# Altium schematic sheet Mikrolysreklamen17.SchDoc
size A3
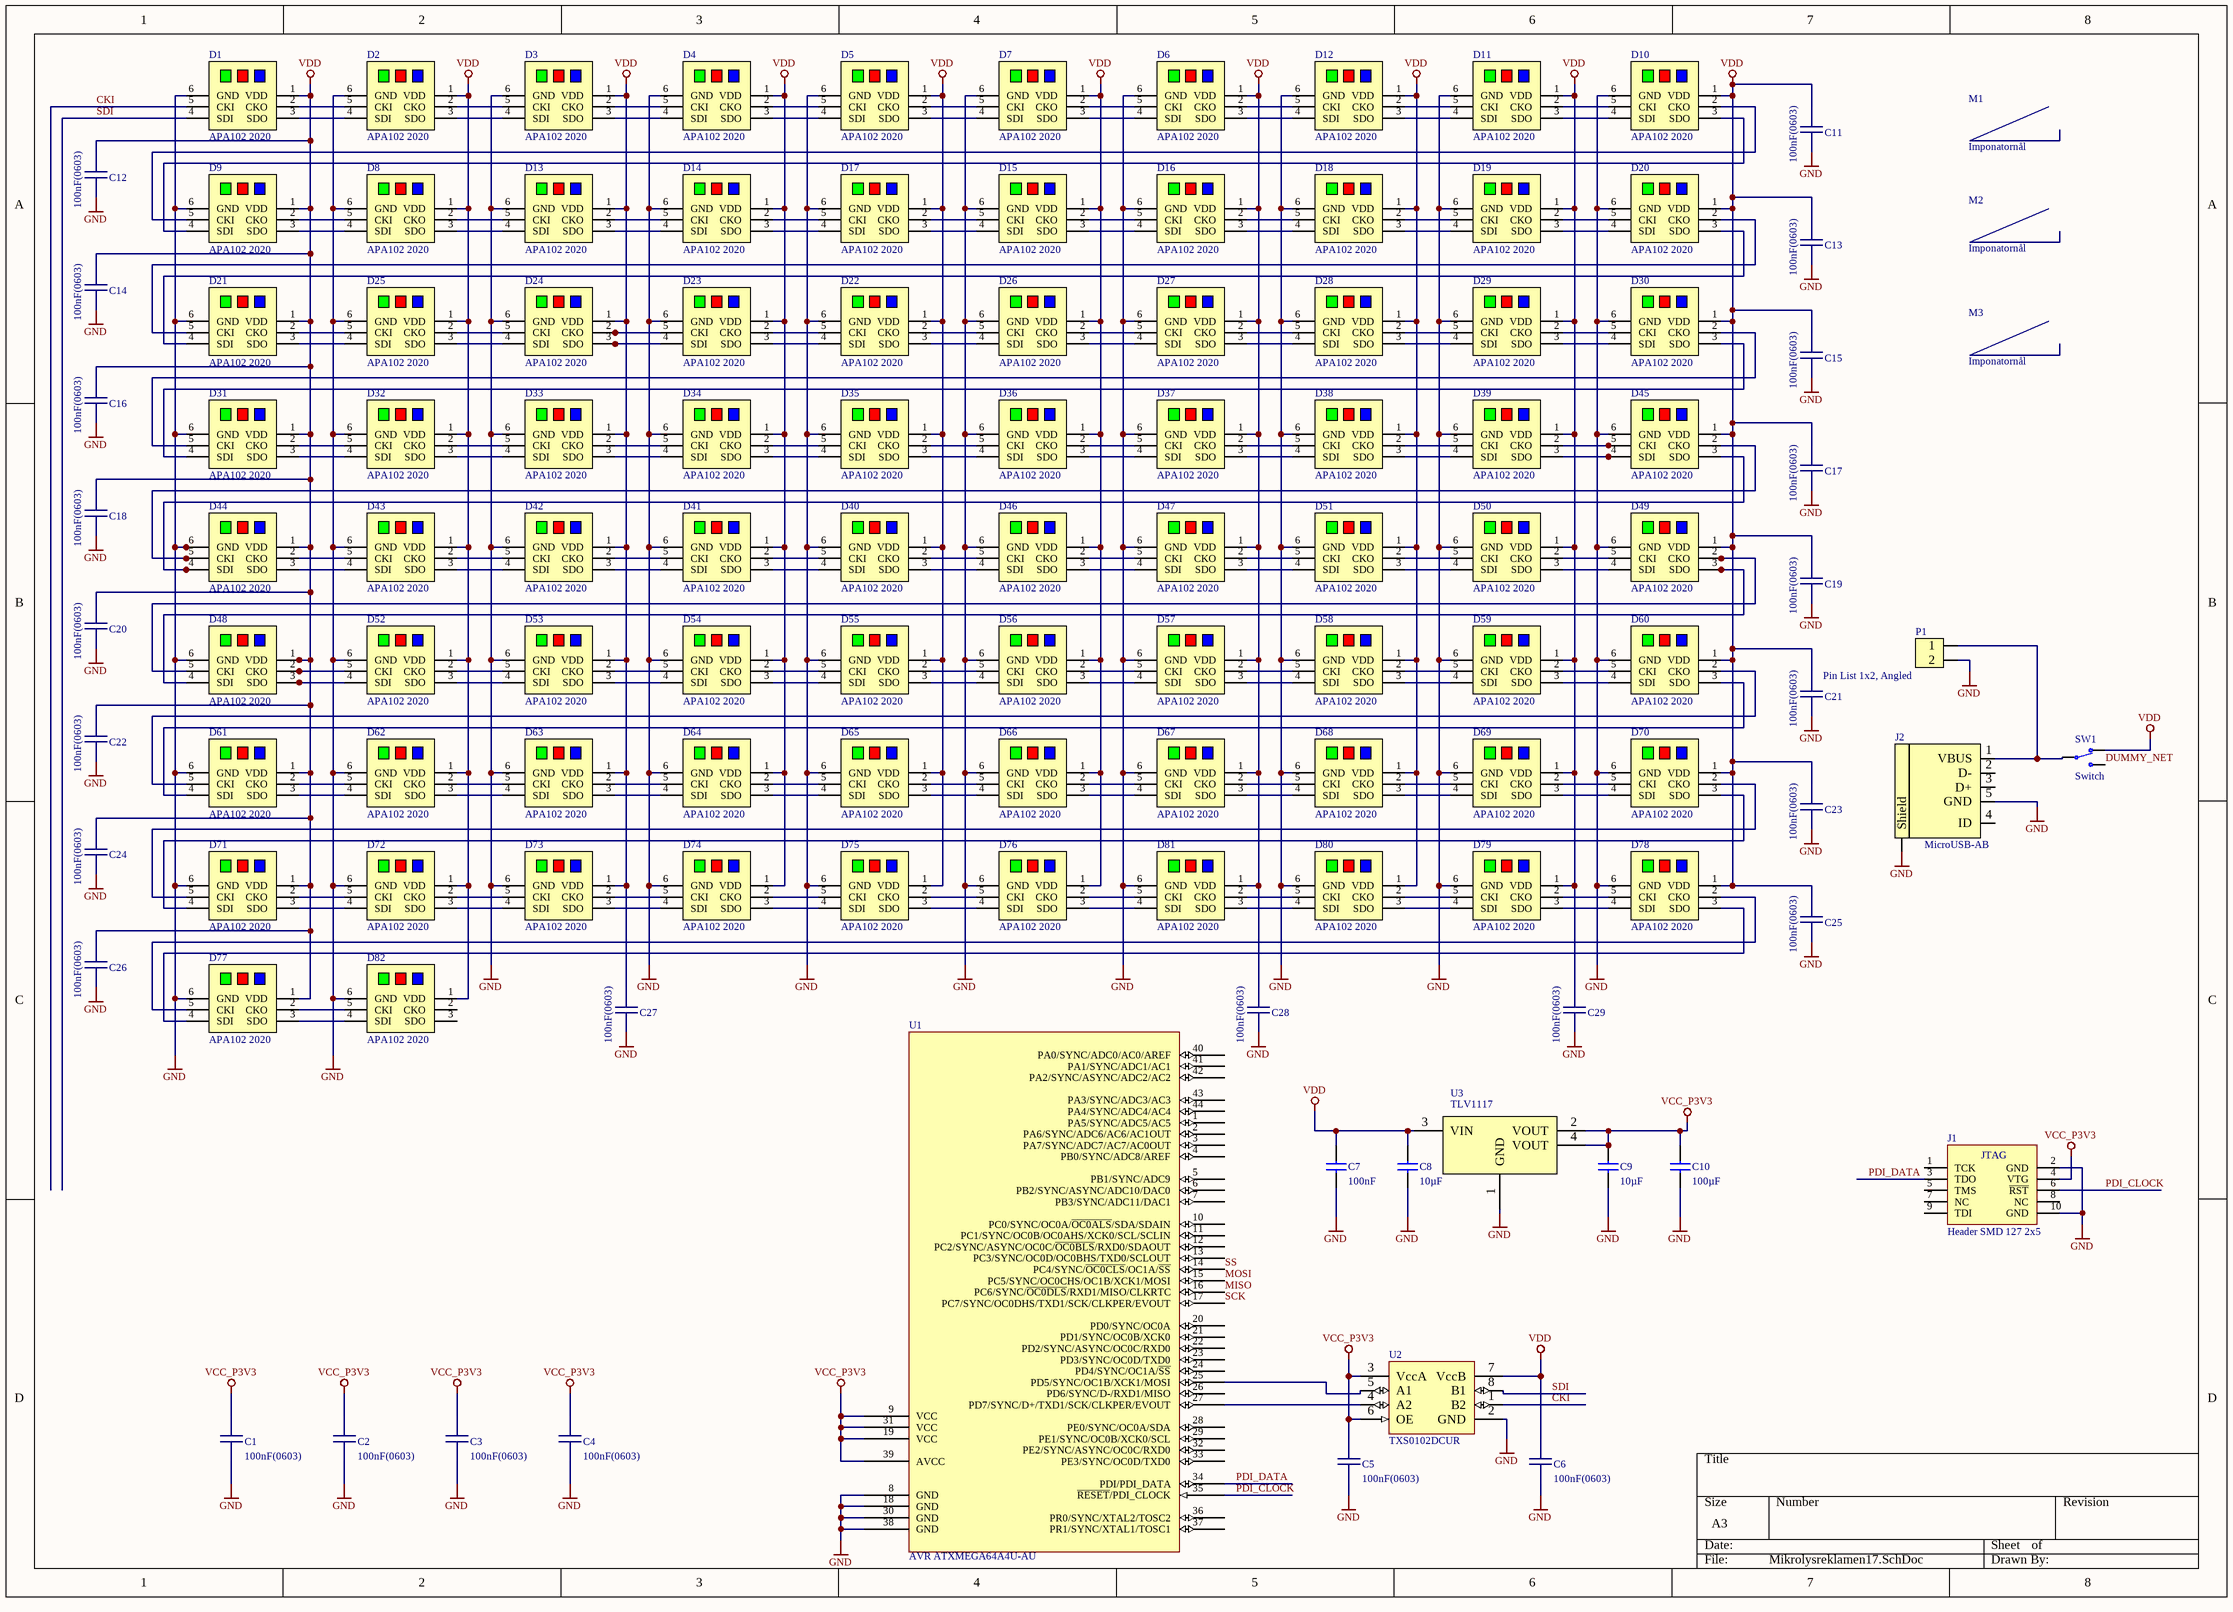
[diagram p0: Mikrolysreklamen17.SchDoc]

## Parts
C1  100nF(0603)  [CAPC0603(1608)55_N]
C2  100nF(0603)  [CAPC0603(1608)55_N]
C3  100nF(0603)  [CAPC0603(1608)55_N]
C4  100nF(0603)  [CAPC0603(1608)55_N]
C5  100nF(0603)  [CAPC0603(1608)55_N]
C6  100nF(0603)  [CAPC0603(1608)55_N]
C7  100nF  [CAPC1005X04L]
C8  10µF  [CAPC1608X06L]
C9  10µF  [CAPC1608X06L]
C10  100µF  [CAPC2012X11L]
C11  100nF(0603)  [CAPC0603(1608)55_N]
C12  100nF(0603)  [CAPC0603(1608)55_N]
C13  100nF(0603)  [CAPC0603(1608)55_N]
C14  100nF(0603)  [CAPC0603(1608)55_N]
C15  100nF(0603)  [CAPC0603(1608)55_N]
C16  100nF(0603)  [CAPC0603(1608)55_N]
C17  100nF(0603)  [CAPC0603(1608)55_N]
C18  100nF(0603)  [CAPC0603(1608)55_N]
C19  100nF(0603)  [CAPC0603(1608)55_N]
C20  100nF(0603)  [CAPC0603(1608)55_N]
C21  100nF(0603)  [CAPC0603(1608)55_N]
C22  100nF(0603)  [CAPC0603(1608)55_N]
C23  100nF(0603)  [CAPC0603(1608)55_N]
C24  100nF(0603)  [CAPC0603(1608)55_N]
C25  100nF(0603)  [CAPC0603(1608)55_N]
C26  100nF(0603)  [CAPC0603(1608)55_N]
C27  100nF(0603)  [CAPC0603(1608)55_N]
C28  100nF(0603)  [CAPC0603(1608)55_N]
C29  100nF(0603)  [CAPC0603(1608)55_N]
D1  APA102 2020  [PCBComponent_1]
D2  APA102 2020  [PCBComponent_1]
D3  APA102 2020  [PCBComponent_1]
D4  APA102 2020  [PCBComponent_1]
D5  APA102 2020  [PCBComponent_1]
D6  APA102 2020  [PCBComponent_1]
D7  APA102 2020  [PCBComponent_1]
D8  APA102 2020  [PCBComponent_1]
D9  APA102 2020  [PCBComponent_1]
D10  APA102 2020  [PCBComponent_1]
D11  APA102 2020  [PCBComponent_1]
D12  APA102 2020  [PCBComponent_1]
D13  APA102 2020  [PCBComponent_1]
D14  APA102 2020  [PCBComponent_1]
D15  APA102 2020  [PCBComponent_1]
D16  APA102 2020  [PCBComponent_1]
D17  APA102 2020  [PCBComponent_1]
D18  APA102 2020  [PCBComponent_1]
D19  APA102 2020  [PCBComponent_1]
D20  APA102 2020  [PCBComponent_1]
D21  APA102 2020  [PCBComponent_1]
D22  APA102 2020  [PCBComponent_1]
D23  APA102 2020  [PCBComponent_1]
D24  APA102 2020  [PCBComponent_1]
D25  APA102 2020  [PCBComponent_1]
D26  APA102 2020  [PCBComponent_1]
D27  APA102 2020  [PCBComponent_1]
D28  APA102 2020  [PCBComponent_1]
D29  APA102 2020  [PCBComponent_1]
D30  APA102 2020  [PCBComponent_1]
D31  APA102 2020  [PCBComponent_1]
D32  APA102 2020  [PCBComponent_1]
D33  APA102 2020  [PCBComponent_1]
D34  APA102 2020  [PCBComponent_1]
D35  APA102 2020  [PCBComponent_1]
D36  APA102 2020  [PCBComponent_1]
D37  APA102 2020  [PCBComponent_1]
D38  APA102 2020  [PCBComponent_1]
D39  APA102 2020  [PCBComponent_1]
D40  APA102 2020  [PCBComponent_1]
D41  APA102 2020  [PCBComponent_1]
D42  APA102 2020  [PCBComponent_1]
D43  APA102 2020  [PCBComponent_1]
D44  APA102 2020  [PCBComponent_1]
D45  APA102 2020  [PCBComponent_1]
D46  APA102 2020  [PCBComponent_1]
D47  APA102 2020  [PCBComponent_1]
D48  APA102 2020  [PCBComponent_1]
D49  APA102 2020  [PCBComponent_1]
D50  APA102 2020  [PCBComponent_1]
D51  APA102 2020  [PCBComponent_1]
D52  APA102 2020  [PCBComponent_1]
D53  APA102 2020  [PCBComponent_1]
D54  APA102 2020  [PCBComponent_1]
D55  APA102 2020  [PCBComponent_1]
D56  APA102 2020  [PCBComponent_1]
D57  APA102 2020  [PCBComponent_1]
D58  APA102 2020  [PCBComponent_1]
D59  APA102 2020  [PCBComponent_1]
D60  APA102 2020  [PCBComponent_1]
D61  APA102 2020  [PCBComponent_1]
D62  APA102 2020  [PCBComponent_1]
D63  APA102 2020  [PCBComponent_1]
D64  APA102 2020  [PCBComponent_1]
D65  APA102 2020  [PCBComponent_1]
D66  APA102 2020  [PCBComponent_1]
D67  APA102 2020  [PCBComponent_1]
D68  APA102 2020  [PCBComponent_1]
D69  APA102 2020  [PCBComponent_1]
D70  APA102 2020  [PCBComponent_1]
D71  APA102 2020  [PCBComponent_1]
D72  APA102 2020  [PCBComponent_1]
D73  APA102 2020  [PCBComponent_1]
D74  APA102 2020  [PCBComponent_1]
D75  APA102 2020  [PCBComponent_1]
D76  APA102 2020  [PCBComponent_1]
D77  APA102 2020  [PCBComponent_1]
D78  APA102 2020  [PCBComponent_1]
D79  APA102 2020  [PCBComponent_1]
D80  APA102 2020  [PCBComponent_1]
D81  APA102 2020  [PCBComponent_1]
D82  APA102 2020  [PCBComponent_1]
J1  Header SMD 127 2x5  [SMDHDRV10P127_2X5_615X330X560B]
J2  MicroUSB-AB  [FCI_10104111-0001LF]
M1  Imponatornål  [Imponatornaal_liten]
M2  Imponatornål  [Imponatornaal_liten]
M3  Imponatornål  [Imponatornaal_liten]
P1  Pin List 1x2, Angled  [LIST_ANG_1x2-SMD-2.54MM]
SW1  Switch  [JS102011SAQN]
U1  AVR ATXMEGA64A4U-AU  [TQFP80P1200X1200X120-44N]
U2  TXS0102DCUR  [TSSOP50P310X90-8N]
U3  TLV1117  [SOT230P700X180-4N]

## Nets
GND: C1.1 C2.1 C3.1 C4.1 C5.1 C6.1 C7.1 C8.1 C9.1 C10.1 C11.1 C12.1 C13.1 C14.1 C15.1 C16.1 C17.1 C18.1 C19.1 C20.1 C21.1 C22.1 C23.1 C24.1 C25.1 C26.1 C27.1 C28.1 C29.1 D1.6(GND) D2.6(GND) D3.6(GND) D4.6(GND) D5.6(GND) D6.6(GND) D7.6(GND) D8.6(GND) D9.6(GND) D10.6(GND) D11.6(GND) D12.6(GND) D13.6(GND) D14.6(GND) D15.6(GND) D16.6(GND) D17.6(GND) D18.6(GND) D19.6(GND) D20.6(GND) D21.6(GND) D22.6(GND) D23.6(GND) D24.6(GND) D25.6(GND) D26.6(GND) D27.6(GND) D28.6(GND) D29.6(GND) D30.6(GND) D31.6(GND) D32.6(GND) D33.6(GND) D34.6(GND) D35.6(GND) D36.6(GND) D37.6(GND) D38.6(GND) D39.6(GND) D40.6(GND) D41.6(GND) D42.6(GND) D43.6(GND) D44.6(GND) D45.6(GND) D46.6(GND) D47.6(GND) D48.6(GND) D49.6(GND) D50.6(GND) D51.6(GND) D52.6(GND) D53.6(GND) D54.6(GND) D55.6(GND) D56.6(GND) D57.6(GND) D58.6(GND) D59.6(GND) D60.6(GND) D61.6(GND) D62.6(GND) D63.6(GND) D64.6(GND) D65.6(GND) D66.6(GND) D67.6(GND) D68.6(GND) D69.6(GND) D70.6(GND) D71.6(GND) D72.6(GND) D73.6(GND) D74.6(GND) D75.6(GND) D76.6(GND) D77.6(GND) D78.6(GND) D79.6(GND) D80.6(GND) D81.6(GND) D82.6(GND) J1.2(GND) J1.10(GND) J2.5(GND) J2.6(Shield) P1.2 U1.8(GND) U1.18(GND) U1.30(GND) U1.38(GND) U2.2(GND) U3.1(GND)
VCC_P3V3: C1.2 C2.2 C3.2 C4.2 C5.2 C9.2 C10.2 J1.4(VTG) U1.9(VCC) U1.19(VCC) U1.31(VCC) U1.39(AVCC) U2.3(VccA) U2.6(OE) U3.2(VOUT) U3.4(VOUT)
VDD: C6.2 C7.2 C8.2 C11.2 C12.2 C13.2 C14.2 C15.2 C16.2 C17.2 C18.2 C19.2 C20.2 C21.2 C22.2 C23.2 C24.2 C25.2 C26.2 C27.2 C28.2 C29.2 D1.1(VDD) D2.1(VDD) D3.1(VDD) D4.1(VDD) D5.1(VDD) D6.1(VDD) D7.1(VDD) D8.1(VDD) D9.1(VDD) D10.1(VDD) D11.1(VDD) D12.1(VDD) D13.1(VDD) D14.1(VDD) D15.1(VDD) D16.1(VDD) D17.1(VDD) D18.1(VDD) D19.1(VDD) D20.1(VDD) D21.1(VDD) D22.1(VDD) D23.1(VDD) D24.1(VDD) D25.1(VDD) D26.1(VDD) D27.1(VDD) D28.1(VDD) D29.1(VDD) D30.1(VDD) D31.1(VDD) D32.1(VDD) D33.1(VDD) D34.1(VDD) D35.1(VDD) D36.1(VDD) D37.1(VDD) D38.1(VDD) D39.1(VDD) D40.1(VDD) D41.1(VDD) D42.1(VDD) D43.1(VDD) D44.1(VDD) D45.1(VDD) D46.1(VDD) D47.1(VDD) D48.1(VDD) D49.1(VDD) D50.1(VDD) D51.1(VDD) D52.1(VDD) D53.1(VDD) D54.1(VDD) D55.1(VDD) D56.1(VDD) D57.1(VDD) D58.1(VDD) D59.1(VDD) D60.1(VDD) D61.1(VDD) D62.1(VDD) D63.1(VDD) D64.1(VDD) D65.1(VDD) D66.1(VDD) D67.1(VDD) D68.1(VDD) D69.1(VDD) D70.1(VDD) D71.1(VDD) D72.1(VDD) D73.1(VDD) D74.1(VDD) D75.1(VDD) D76.1(VDD) D77.1(VDD) D78.1(VDD) D79.1(VDD) D80.1(VDD) D81.1(VDD) D82.1(VDD) SW1.1(N.C) U2.7(VccB) U3.3(VIN)
CKI: D1.5(CKI) U2.1(B2)
DUMMY_NET: SW1.3(N.O)
MISO: U1.16(PC6/SYNC/~{OC0DLS}/RXD1/MISO/CLKRTC)
MOSI: U1.15(PC5/SYNC/OC0CHS/OC1B/XCK1/MOSI)
PDI_CLOCK: J1.6(~{RST}) U1.35(~{RESET}/PDI_CLOCK)
PDI_DATA: J1.3(TDO) U1.34(PDI/PDI_DATA)
SCK: U1.17(PC7/SYNC/OC0DHS/TXD1/SCK/CLKPER/EVOUT)
SDI: D1.4(SDI) U2.8(B1)
SS: U1.14(PC4/SYNC/~{OC0CLS}/OC1A/~{SS})
NetD1_2: D1.2(CKO) D2.5(CKI)
NetD1_3: D1.3(SDO) D2.4(SDI)
NetD2_2: D2.2(CKO) D3.5(CKI)
NetD2_3: D2.3(SDO) D3.4(SDI)
NetD3_2: D3.2(CKO) D4.5(CKI)
NetD3_3: D3.3(SDO) D4.4(SDI)
NetD4_2: D4.2(CKO) D5.5(CKI)
NetD4_3: D4.3(SDO) D5.4(SDI)
NetD5_2: D5.2(CKO) D7.5(CKI)
NetD5_3: D5.3(SDO) D7.4(SDI)
NetD6_2: D6.2(CKO) D12.5(CKI)
NetD6_3: D6.3(SDO) D12.4(SDI)
NetD6_4: D6.4(SDI) D7.3(SDO)
NetD6_5: D6.5(CKI) D7.2(CKO)
NetD8_2: D8.2(CKO) D13.5(CKI)
NetD8_3: D8.3(SDO) D13.4(SDI)
NetD8_4: D8.4(SDI) D9.3(SDO)
NetD8_5: D8.5(CKI) D9.2(CKO)
NetD9_4: D9.4(SDI) D10.3(SDO)
NetD9_5: D9.5(CKI) D10.2(CKO)
NetD10_4: D10.4(SDI) D11.3(SDO)
NetD10_5: D10.5(CKI) D11.2(CKO)
NetD11_4: D11.4(SDI) D12.3(SDO)
NetD11_5: D11.5(CKI) D12.2(CKO)
NetD13_2: D13.2(CKO) D14.5(CKI)
NetD13_3: D13.3(SDO) D14.4(SDI)
NetD14_2: D14.2(CKO) D17.5(CKI)
NetD14_3: D14.3(SDO) D17.4(SDI)
NetD15_2: D15.2(CKO) D16.5(CKI)
NetD15_3: D15.3(SDO) D16.4(SDI)
NetD15_4: D15.4(SDI) D17.3(SDO)
NetD15_5: D15.5(CKI) D17.2(CKO)
NetD16_2: D16.2(CKO) D18.5(CKI)
NetD16_3: D16.3(SDO) D18.4(SDI)
NetD18_2: D18.2(CKO) D19.5(CKI)
NetD18_3: D18.3(SDO) D19.4(SDI)
NetD19_2: D19.2(CKO) D20.5(CKI)
NetD19_3: D19.3(SDO) D20.4(SDI)
NetD20_2: D20.2(CKO) D21.5(CKI)
NetD20_3: D20.3(SDO) D21.4(SDI)
NetD21_2: D21.2(CKO) D25.5(CKI)
NetD21_3: D21.3(SDO) D25.4(SDI)
NetD22_2: D22.2(CKO) D26.5(CKI)
NetD22_3: D22.3(SDO) D26.4(SDI)
NetD22_4: D22.4(SDI) D23.3(SDO)
NetD22_5: D22.5(CKI) D23.2(CKO)
NetD23_4: D23.4(SDI) D24.3(SDO)
NetD23_5: D23.5(CKI) D24.2(CKO)
NetD24_4: D24.4(SDI) D25.3(SDO)
NetD24_5: D24.5(CKI) D25.2(CKO)
NetD26_2: D26.2(CKO) D27.5(CKI)
NetD26_3: D26.3(SDO) D27.4(SDI)
NetD27_2: D27.2(CKO) D28.5(CKI)
NetD27_3: D27.3(SDO) D28.4(SDI)
NetD28_2: D28.2(CKO) D29.5(CKI)
NetD28_3: D28.3(SDO) D29.4(SDI)
NetD29_2: D29.2(CKO) D30.5(CKI)
NetD29_3: D29.3(SDO) D30.4(SDI)
NetD30_2: D30.2(CKO) D31.5(CKI)
NetD30_3: D30.3(SDO) D31.4(SDI)
NetD31_2: D31.2(CKO) D32.5(CKI)
NetD31_3: D31.3(SDO) D32.4(SDI)
NetD32_2: D32.2(CKO) D33.5(CKI)
NetD32_3: D32.3(SDO) D33.4(SDI)
NetD33_2: D33.2(CKO) D34.5(CKI)
NetD33_3: D33.3(SDO) D34.4(SDI)
NetD34_2: D34.2(CKO) D35.5(CKI)
NetD34_3: D34.3(SDO) D35.4(SDI)
NetD35_2: D35.2(CKO) D36.5(CKI)
NetD35_3: D35.3(SDO) D36.4(SDI)
NetD36_2: D36.2(CKO) D37.5(CKI)
NetD36_3: D36.3(SDO) D37.4(SDI)
NetD37_2: D37.2(CKO) D38.5(CKI)
NetD37_3: D37.3(SDO) D38.4(SDI)
NetD38_2: D38.2(CKO) D39.5(CKI)
NetD38_3: D38.3(SDO) D39.4(SDI)
NetD39_2: D39.2(CKO) D45.5(CKI)
NetD39_3: D39.3(SDO) D45.4(SDI)
NetD40_2: D40.2(CKO) D46.5(CKI)
NetD40_3: D40.3(SDO) D46.4(SDI)
NetD40_4: D40.4(SDI) D41.3(SDO)
NetD40_5: D40.5(CKI) D41.2(CKO)
NetD41_4: D41.4(SDI) D42.3(SDO)
NetD41_5: D41.5(CKI) D42.2(CKO)
NetD42_4: D42.4(SDI) D43.3(SDO)
NetD42_5: D42.5(CKI) D43.2(CKO)
NetD43_4: D43.4(SDI) D44.3(SDO)
NetD43_5: D43.5(CKI) D44.2(CKO)
NetD44_4: D44.4(SDI) D45.3(SDO)
NetD44_5: D44.5(CKI) D45.2(CKO)
NetD46_2: D46.2(CKO) D47.5(CKI)
NetD46_3: D46.3(SDO) D47.4(SDI)
NetD47_2: D47.2(CKO) D51.5(CKI)
NetD47_3: D47.3(SDO) D51.4(SDI)
NetD48_2: D48.2(CKO) D52.5(CKI)
NetD48_3: D48.3(SDO) D52.4(SDI)
NetD48_4: D48.4(SDI) D49.3(SDO)
NetD48_5: D48.5(CKI) D49.2(CKO)
NetD49_4: D49.4(SDI) D50.3(SDO)
NetD49_5: D49.5(CKI) D50.2(CKO)
NetD50_4: D50.4(SDI) D51.3(SDO)
NetD50_5: D50.5(CKI) D51.2(CKO)
NetD52_2: D52.2(CKO) D53.5(CKI)
NetD52_3: D52.3(SDO) D53.4(SDI)
NetD53_2: D53.2(CKO) D54.5(CKI)
NetD53_3: D53.3(SDO) D54.4(SDI)
NetD54_2: D54.2(CKO) D55.5(CKI)
NetD54_3: D54.3(SDO) D55.4(SDI)
NetD55_2: D55.2(CKO) D56.5(CKI)
NetD55_3: D55.3(SDO) D56.4(SDI)
NetD56_2: D56.2(CKO) D57.5(CKI)
NetD56_3: D56.3(SDO) D57.4(SDI)
NetD57_2: D57.2(CKO) D58.5(CKI)
NetD57_3: D57.3(SDO) D58.4(SDI)
NetD58_2: D58.2(CKO) D59.5(CKI)
NetD58_3: D58.3(SDO) D59.4(SDI)
NetD59_2: D59.2(CKO) D60.5(CKI)
NetD59_3: D59.3(SDO) D60.4(SDI)
NetD60_2: D60.2(CKO) D61.5(CKI)
NetD60_3: D60.3(SDO) D61.4(SDI)
NetD61_2: D61.2(CKO) D62.5(CKI)
NetD61_3: D61.3(SDO) D62.4(SDI)
NetD62_2: D62.2(CKO) D63.5(CKI)
NetD62_3: D62.3(SDO) D63.4(SDI)
NetD63_2: D63.2(CKO) D64.5(CKI)
NetD63_3: D63.3(SDO) D64.4(SDI)
NetD64_2: D64.2(CKO) D65.5(CKI)
NetD64_3: D64.3(SDO) D65.4(SDI)
NetD65_2: D65.2(CKO) D66.5(CKI)
NetD65_3: D65.3(SDO) D66.4(SDI)
NetD66_2: D66.2(CKO) D67.5(CKI)
NetD66_3: D66.3(SDO) D67.4(SDI)
NetD67_2: D67.2(CKO) D68.5(CKI)
NetD67_3: D67.3(SDO) D68.4(SDI)
NetD68_2: D68.2(CKO) D69.5(CKI)
NetD68_3: D68.3(SDO) D69.4(SDI)
NetD69_2: D69.2(CKO) D70.5(CKI)
NetD69_3: D69.3(SDO) D70.4(SDI)
NetD70_2: D70.2(CKO) D71.5(CKI)
NetD70_3: D70.3(SDO) D71.4(SDI)
NetD71_2: D71.2(CKO) D72.5(CKI)
NetD71_3: D71.3(SDO) D72.4(SDI)
NetD72_2: D72.2(CKO) D73.5(CKI)
NetD72_3: D72.3(SDO) D73.4(SDI)
NetD73_2: D73.2(CKO) D74.5(CKI)
NetD73_3: D73.3(SDO) D74.4(SDI)
NetD74_2: D74.2(CKO) D75.5(CKI)
NetD74_3: D74.3(SDO) D75.4(SDI)
NetD75_2: D75.2(CKO) D76.5(CKI)
NetD75_3: D75.3(SDO) D76.4(SDI)
NetD76_2: D76.2(CKO) D81.5(CKI)
NetD76_3: D76.3(SDO) D81.4(SDI)
NetD77_2: D77.2(CKO) D82.5(CKI)
NetD77_3: D77.3(SDO) D82.4(SDI)
NetD77_4: D77.4(SDI) D78.3(SDO)
NetD77_5: D77.5(CKI) D78.2(CKO)
NetD78_4: D78.4(SDI) D79.3(SDO)
NetD78_5: D78.5(CKI) D79.2(CKO)
NetD79_4: D79.4(SDI) D80.3(SDO)
NetD79_5: D79.5(CKI) D80.2(CKO)
NetD80_4: D80.4(SDI) D81.3(SDO)
NetD80_5: D80.5(CKI) D81.2(CKO)
NetJ2_1: J2.1(VBUS) P1.1 SW1.2(COM)
NetU1_25: U1.25(PD5/SYNC/OC1B/XCK1/MOSI) U2.5(A1)
NetU1_27: U1.27(PD7/SYNC/D+/TXD1/SCK/CLKPER/EVOUT) U2.4(A2)

Not connected (* = marked no-connect by the designer): D82 2(CKO) 3(SDO); J1 1(TCK) 5(TMS) 7(NC) 8(NC) 9(TDI); J2 2(D-) 3(D+) 4(ID); U1 1(PA5/SYNC/ADC5/AC5) 2(PA6/SYNC/ADC6/AC6/AC1OUT) 3(PA7/SYNC/ADC7/AC7/AC0OUT) 4(PB0/SYNC/ADC8/AREF) 5(PB1/SYNC/ADC9) 6(PB2/SYNC/ASYNC/ADC10/DAC0) 7(PB3/SYNC/ADC11/DAC1) 10(PC0/SYNC/OC0A/~{OC0ALS}/SDA/SDAIN) 11(PC1/SYNC/OC0B/OC0AHS/XCK0/SCL/SCLIN) 12(PC2/SYNC/ASYNC/OC0C/~{OC0BLS}/RXD0/SDAOUT) 13(PC3/SYNC/OC0D/OC0BHS/TXD0/SCLOUT) 20(PD0/SYNC/OC0A) 21(PD1/SYNC/OC0B/XCK0) 22(PD2/SYNC/ASYNC/OC0C/RXD0) 23(PD3/SYNC/OC0D/TXD0) 24(PD4/SYNC/OC1A/~{SS}) 26(PD6/SYNC/D-/RXD1/MISO) 28(PE0/SYNC/OC0A/SDA) 29(PE1/SYNC/OC0B/XCK0/SCL) 32(PE2/SYNC/ASYNC/OC0C/RXD0) 33(PE3/SYNC/OC0D/TXD0) 36(PR0/SYNC/XTAL2/TOSC2) 37(PR1/SYNC/XTAL1/TOSC1) 40(PA0/SYNC/ADC0/AC0/AREF) 41(PA1/SYNC/ADC1/AC1) 42(PA2/SYNC/ASYNC/ADC2/AC2) 43(PA3/SYNC/ADC3/AC3) 44(PA4/SYNC/ADC4/AC4)

## Library data of the parts
C1-C6 C11-C29 = 3028: 100nF 0603 5% X7R 50V; pakke_opprettet_av: 815; leverandor_varenr: 1759122; pris: 1; nokkelord: Kondensator, Capacitor, CAP; pakketype: 93; produsent: Multikomp; leverandor: Farnell; id: 3028; navn: 100nF(0603); pakke_opprettet: 18.02.2015 14:18:13; symbol_opprettet_av: 815; symbol_opprettet: 14.11.2014 20:19:34
C7 = C0402-100n: Capacitor, X7R, ±10%; Note: 16V; Artikkelnr Noca: 20039200; Artikkelnr Simpro: N.A.; Part Number: C0402-100n; Manufacturer: *; Manufacturer Part Number: *; Datasheet: *; Footprint Doc: 0402; LatestRevisionDate: 2009-11-23; Pin Count: 2; Publisher: Nordic Semiconductor; Published: 2009-05-08; Value: 100nF; Supplier: *; Supplier part number: *; 2nd source Supplier: *; 2nd source part number: *
C8 C9 = C0603-10µ: Capacitor, X5R, ±20%; Note: 6.3V; Artikkelnr Noca: 20039234; Artikkelnr Simpro: N.A.; Part Number: C0603-10µ; Manufacturer: *; Manufacturer Part Number: *; Datasheet: *; Footprint Doc: 0603; LatestRevisionDate: 2011-01-17; Pin Count: 2; Publisher: Nordic Semiconductor; Published: 2011-01-17; Value: 10µF; Supplier: *; Supplier part number: *; 2nd source Supplier: *; 2nd source part number: *
C10 = C0805-TBD: Chip Cap 0805; Artikkelnr Noca: N.A.; Part Number: C0805-TBD; Manufacturer: *; Manufacturer Part Number: *; Datasheet: *; Footprint Doc: 0805; LatestRevisionDate: 2013-12-17; Pin Count: 2; Publisher: Nordic Semiconductor; Published: 2013-12-17; Value: 100µF; Note: Chip Cap; Supplier: *; Supplier part number: *; 2nd source Supplier: *; 2nd source part number: *; Artikkelnr Simpro: N.A.
D1-D82 = APA102_2020: AdaFruit: 3341; DigiKey: 1528-2392-ND
J1 = 2449: 1,27mm Pitch SMD Header; id: 2449; pakke_opprettet_av: 815; pris: 20; nokkelord: JTAG; pakketype: 101; pakke_opprettet: 15.11.2014 18:30:38; symbol_opprettet_av: 815; symbol_opprettet: 15.11.2014 18:33:29; navn: Header SMD 127 2x5
J2 = FCI 10104111-0001LF: MicroUSB-AB-SMT; Manufacturer: FCI; Part number IPS: N.A.; Artikkelnr Noca: 55029118; Part Number: FCI 10104111-0001LF; Manufacturer Part Number: 10104111-0001LF; ComponentLink1URL: *; ComponentLink1Description: Datasheet; ComponentLink2URL: *; ComponentLink2Description: Supplier link; HelpURL: http://portal.fciconnect.com/Comergent//fci/drawing/10104111.pdf; Footprint Doc: FCI_10104111-0001LF; LatestRevisionDate: 2014-01-14; Pin Count: 5; Publisher: Nordic Semiconductor; Published: 2014-01-14; Value: MicroUSB-AB; Note: *; Supplier 1: Digi-Key; Supplier Part Number 1: 609-4053-1-ND; Supplier 2: Mouser; Supplier Part Number 2: 649-10104111-0001LF
M1-M3 = 3331: nål til imponatorplate 20mm (Brooch back); id: 3331; rad: 0; rom: OV; lager_type: Fremlager; dybde: 1; hylle: 4; antall: 41; pakke_opprettet_av: 815; leverandor_varenr: 600721; pris: 5; nokkelord: cchobby.no; produsent: Jewellery Maker; pakketype: SMD; pakke_opprettet: 15.11.2018 22:49:40; symbol_opprettet_av: 815; symbol_opprettet: 23.10.2015 21:10:45; navn: Imponatornål
P1 = Pin List Ang 1x2 SMD, 2.54mm: Pin List 1x2, 2.54mm (100mil), Right Angled, SMD; Manufacturer: W-CON; Manufacturer Part Number: 1125B-1102S0Z135R2; Part number IPS: N.A.; Artikkelnr Noca: 55010023; Part Number: Pin List Ang 1x2 SMD, 2.54mm; ComponentLink1URL: *; ComponentLink1Description: Datasheet; ComponentLink2URL: *; ComponentLink2Description: Supplier link; HelpURL: \\hizz\pro\app9717\Datasheet\connectores\W-CON\1125B-11XXXXZXXXXX.pdf; Footprint Doc: LIST_ANG_1x2-SMD-2.54MM; LatestRevisionDate: 2016-05-26; Pin Count: 2; Publisher: Nordic Semiconductor; Published: 2016-01-22; Value: Pin List 1x2, Angled; Note: *; Supplier 1: Cabcon; Supplier Part Number 1: 1125B-1102S0Z135R2; Supplier 2: Samtec; Supplier Part Number 2: TSM-102-01-L-SH-A
SW1 = JS102011SAQN: SMD slide Switch (ON-ON); Manufacturer: C&K Components; Part number IPS: N.A.; Artikkelnr Noca: 50019064; Part Number: JS102011SAQN; Manufacturer Part Number: JS102011SAQN; ComponentLink1URL: *; ComponentLink1Description: Datasheet; ComponentLink2URL: *; ComponentLink2Description: Supplier link; HelpURL: http://www.ck-components.com/14398/js_14july11.pdf/; Footprint Doc: JS102011SAQN; LatestRevisionDate: 2011-08-15; Pin Count: 3; Publisher: Nordic Semiconductor; Published: 2011-08-15; Value: Switch; Note: *; Supplier 1: Digi-Key; Supplier Part Number 1: 401-1999-1-ND; Supplier 2: Mouser; Supplier Part Number 2: 611-JS102011SAQN
U1 = 2103: Mikrokontroller; id: 2103; rad: 4; rom: OV; lager_type: Fremlager; dybde: 0; antall: 75; kolonne: 2; pakke_opprettet_av: 774; pakketype: 45; produsent: Atmel; hylle: 0; pakke_opprettet: 22.08.2014 14:00:28; symbol_opprettet_av: 774; symbol_opprettet: 22.08.2014 14:00:55; navn: AVR ATXMEGA64A4U-AU; pris: 0
U2 = TXS0102DCUR: IC VOLT-LEVEL TRANSLATOR 8-US8; Manufacturer: Texas Instruments; Note: TEXAS INSTRUMENTS - TXS0102DCUR - IC, TRANSLATOR; Artikkelnr Noca: N.A.; Part Number: TXS0102DCUR; Manufacturer Part Number: TXS0102DCUR; ComponentLink1URL: *; ComponentLink1Description: Datasheet; ComponentLink2URL: *; ComponentLink2Description: Supplier link; HelpURL: http://www.ti.com/lit/ds/symlink/txs0102.pdf; Footprint Doc: 8-VFSOP; LatestRevisionDate: 2012-09-06; Pin Count: 8; Publisher: Nordic Semiconductor; Published: 2012-09-06; Value: TXS0102DCUR; Supplier 1: Digi-Key; Supplier Part Number 1: 296-21931-1-ND; Supplier 2: Farnell; Supplier Part Number 2: 170-3315; Part number IPS: N.A.
U3 = TLV1117-33CDCYR: REG LDO 3.3V 0.8A SOT223; Manufacturer: Texas Instruments; Artikkelnr Noca: N.A.; Part Number: TLV1117-33CDCYR; Manufacturer Part Number: TLV1117-33CDCYR; ComponentLink1URL: http://www.ti.com/lit/ds/symlink/tlv1117.pdf; ComponentLink1Description: Datasheet; ComponentLink2URL: *; ComponentLink2Description: Supplier link; HelpURL: *; Footprint Doc: SOT-223; LatestRevisionDate: 2018-08-10; Pin Count: 4; Publisher: Nordic Semiconductor; Published: 2018-08-10; Value: TLV1117; Note: *; Supplier 1: Digi-Key; Supplier Part Number 1: 296-21112-1-ND; Supplier 2: *; Supplier Part Number 2: *; Part number IPS: N.A.